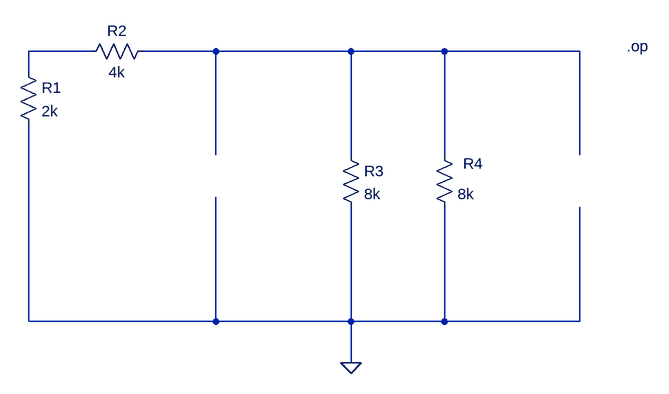
[diagram p0: schematic Cancel-sources.asc]
Cancel-sources.asc, the LTspice schematic file:
Version 4
SHEET 1 880 680
WIRE -144 -16 -240 -16
WIRE 48 -16 -64 -16
WIRE 256 -16 48 -16
WIRE 400 -16 256 -16
WIRE 608 -16 400 -16
WIRE -240 16 -240 -16
WIRE 48 144 48 -16
WIRE 256 144 256 -16
WIRE 400 144 400 -16
WIRE 608 144 608 -16
WIRE -240 400 -240 96
WIRE 48 400 48 208
WIRE 48 400 -240 400
WIRE 256 400 256 224
WIRE 256 400 48 400
WIRE 400 400 400 224
WIRE 400 400 256 400
WIRE 608 400 608 224
WIRE 608 400 400 400
WIRE 256 464 256 400
FLAG 256 464 0
SYMBOL res -256 0 R0
SYMATTR InstName R1
SYMATTR Value 2k
SYMBOL res -48 -32 R90
WINDOW 0 0 56 VBottom 2
WINDOW 3 32 56 VTop 2
SYMATTR InstName R2
SYMATTR Value 4k
SYMBOL res 240 128 R0
SYMATTR InstName R3
SYMATTR Value 8k
SYMBOL res 384 128 R0
WINDOW 0 45 29 Left 2
SYMATTR InstName R4
SYMATTR Value 8k
TEXT 680 -24 Left 2 !.op

The netlist it stands for:
* Cancel-sources.asc
R1 N001 0 2k
R2 N002 N001 4k
R3 N002 0 8k
R4 N002 0 8k
.op
.backanno
.end